# Altium project HPBIController.PrjPCB (part 2 of 8)

## Sheet ADC.SchDoc: 02290_Sonoma_Controller
size B; ApprovedBy: J Johnson; CheckedBy: J Johnson; Author: sdfasdfdfAEFfasdFfaF; DrawnBy: J Johnson; Organization: Opsero Electronic Design; Address1: 21-915 Av. Marguerite-Bourgeoys; Address2: Québec (QC); Address3: G1S 3X4; DocumentNumber: OP009-001-SCH; Revision: D-1; SheetNumber: 15; SheetTotal: 16; Tel1: (581) 308-8830; Tel2: (581) 308-8830; Project: 02290_Sonoma_Controller; CheckedDate: 2013-12-13; Sheet: ADC 3Msps 12-bit 16-channel; PageSetup: Record=PageOptions|CenterHorizontal=True|CenterVertical=True|PrintScale=1.08|XCorrection=1.00|YCorrection=1.00|PrintKind=0|BorderSize=5000000|LeftOffset=0|BottomOffset=0|Orientation=2|PaperLength=1000|PaperWidth=1000|Scale=100|PaperSource=7|PrintQuality=-4|MediaType=1|DitherType=10|PaperKind=Tabloid     [11 x 17 in]|PrintScaleMode=1; DrawDate: 2013-12-13; SchTitle: 02290_Sonoma_Controller; RevDescription: Replaced Q2,Q3 with STD16NF06LT4; RevDate: 2020-07-07; RevBy: J Johnson; RevDescription2: Added resistors to QSPI interface; ModifiedDate: 2020-07-07
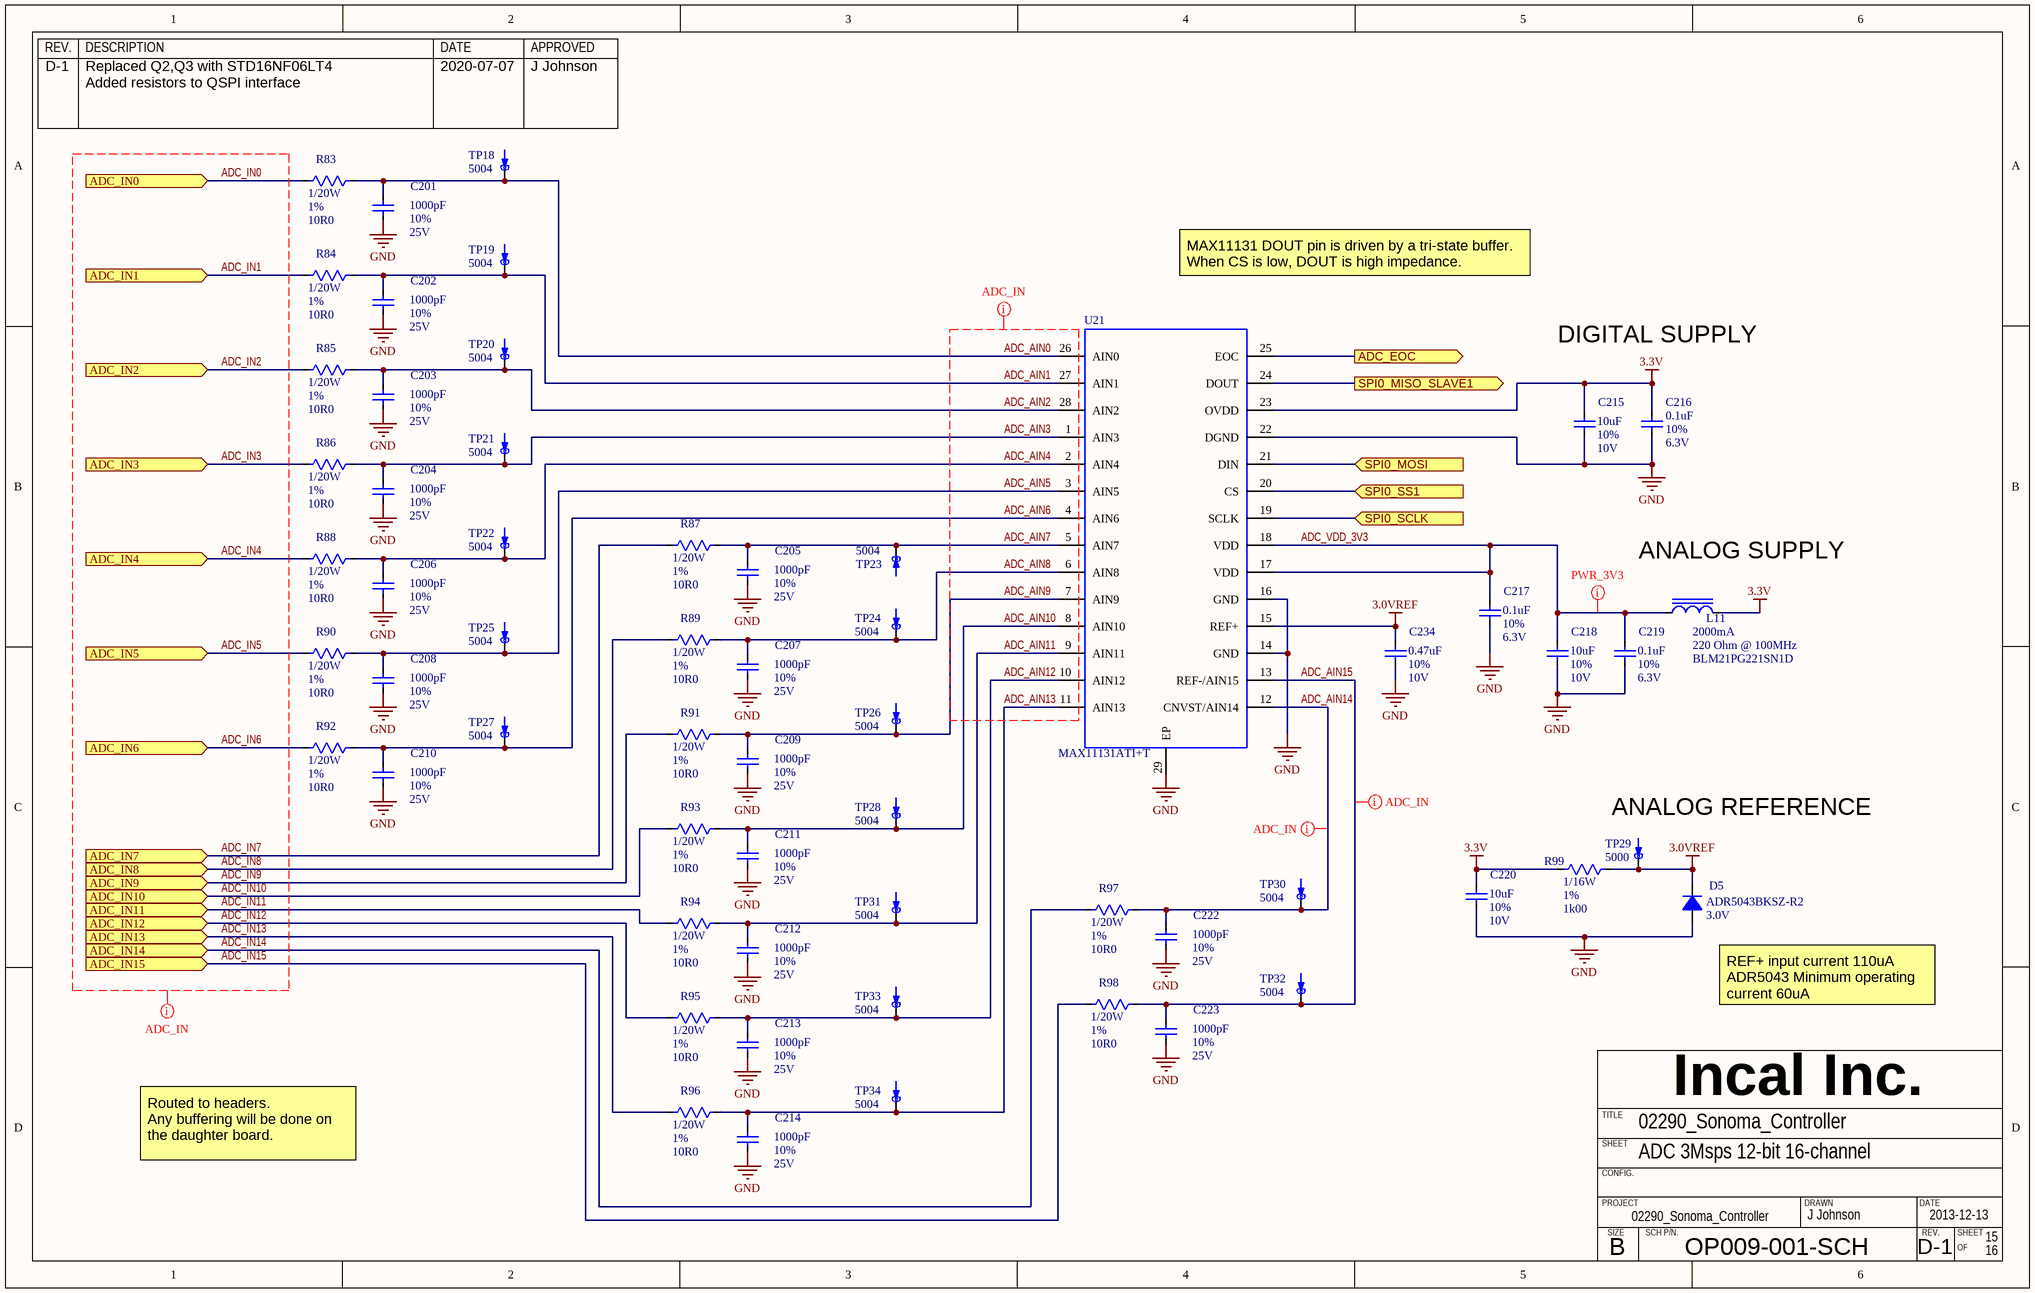
[diagram p1: ADC.SchDoc]

### Parts
C201  value 1000pF  Tolerance: 10%  Voltage: 25V  [CAPC0603X33N]  (hidden comment: CAPACITOR_NP_TYPE1)
C202  value 1000pF  Tolerance: 10%  Voltage: 25V  [CAPC0603X33N]  (hidden comment: CAPACITOR_NP_TYPE1)
C203  value 1000pF  Tolerance: 10%  Voltage: 25V  [CAPC0603X33N]  (hidden comment: CAPACITOR_NP_TYPE1)
C204  value 1000pF  Tolerance: 10%  Voltage: 25V  [CAPC0603X33N]  (hidden comment: CAPACITOR_NP_TYPE1)
C205  value 1000pF  Tolerance: 10%  Voltage: 25V  [CAPC0603X33N]  (hidden comment: CAPACITOR_NP_TYPE1)
C206  value 1000pF  Tolerance: 10%  Voltage: 25V  [CAPC0603X33N]  (hidden comment: CAPACITOR_NP_TYPE1)
C207  value 1000pF  Tolerance: 10%  Voltage: 25V  [CAPC0603X33N]  (hidden comment: CAPACITOR_NP_TYPE1)
C208  value 1000pF  Tolerance: 10%  Voltage: 25V  [CAPC0603X33N]  (hidden comment: CAPACITOR_NP_TYPE1)
C209  value 1000pF  Tolerance: 10%  Voltage: 25V  [CAPC0603X33N]  (hidden comment: CAPACITOR_NP_TYPE1)
C210  value 1000pF  Tolerance: 10%  Voltage: 25V  [CAPC0603X33N]  (hidden comment: CAPACITOR_NP_TYPE1)
C211  value 1000pF  Tolerance: 10%  Voltage: 25V  [CAPC0603X33N]  (hidden comment: CAPACITOR_NP_TYPE1)
C212  value 1000pF  Tolerance: 10%  Voltage: 25V  [CAPC0603X33N]  (hidden comment: CAPACITOR_NP_TYPE1)
C213  value 1000pF  Tolerance: 10%  Voltage: 25V  [CAPC0603X33N]  (hidden comment: CAPACITOR_NP_TYPE1)
C214  value 1000pF  Tolerance: 10%  Voltage: 25V  [CAPC0603X33N]  (hidden comment: CAPACITOR_NP_TYPE1)
C215  value 10uF  Tolerance: 10%  Voltage: 10V  [CAPC1608X38N]  (hidden comment: CAPACITOR_NP_TYPE1)
C216  value 0.1uF  Tolerance: 10%  Voltage: 6.3V  [CAPC0603X33N]  (hidden comment: CAPACITOR_NP_TYPE1)
C217  value 0.1uF  Tolerance: 10%  Voltage: 6.3V  [CAPC0603X33N]  (hidden comment: CAPACITOR_NP_TYPE1)
C218  value 10uF  Tolerance: 10%  Voltage: 10V  [CAPC1608X38N]  (hidden comment: CAPACITOR_NP_TYPE1)
C219  value 0.1uF  Tolerance: 10%  Voltage: 6.3V  [CAPC0603X33N]  (hidden comment: CAPACITOR_NP_TYPE1)
C220  value 10uF  Tolerance: 10%  Voltage: 10V  [CAPC1608X38N]  (hidden comment: CAPACITOR_NP_TYPE1)
C222  value 1000pF  Tolerance: 10%  Voltage: 25V  [CAPC0603X33N]  (hidden comment: CAPACITOR_NP_TYPE1)
C223  value 1000pF  Tolerance: 10%  Voltage: 25V  [CAPC0603X33N]  (hidden comment: CAPACITOR_NP_TYPE1)
C234  value 0.47uF  Tolerance: 10%  Voltage: 10V  [CAPC1005X55N]  (hidden comment: CAPACITOR_NP_TYPE1)
D5  value 3.0V  Mfg Part Number 1: ADR5043BKSZ-R2  [SOT65P210X110-3N]  (hidden comment: DIODE_TYPE3)
L11  value 220 Ohm @ 100MHz  Current: 2000mA  Mfg Part Number 1: BLM21PG221SN1D  [INDC2012X85N]  (hidden comment: INDUCTOR_CORE_TYPE1)
R83  value 10R0  Power: 1/20W  Tolerance: 1%  [RESC1005X33N]  (hidden comment: *)
R84  value 10R0  Power: 1/20W  Tolerance: 1%  [RESC1005X33N]  (hidden comment: *)
R85  value 10R0  Power: 1/20W  Tolerance: 1%  [RESC1005X33N]  (hidden comment: *)
R86  value 10R0  Power: 1/20W  Tolerance: 1%  [RESC1005X33N]  (hidden comment: *)
R87  value 10R0  Power: 1/20W  Tolerance: 1%  [RESC1005X33N]  (hidden comment: *)
R88  value 10R0  Power: 1/20W  Tolerance: 1%  [RESC1005X33N]  (hidden comment: *)
R89  value 10R0  Power: 1/20W  Tolerance: 1%  [RESC1005X33N]  (hidden comment: *)
R90  value 10R0  Power: 1/20W  Tolerance: 1%  [RESC1005X33N]  (hidden comment: *)
R91  value 10R0  Power: 1/20W  Tolerance: 1%  [RESC1005X33N]  (hidden comment: *)
R92  value 10R0  Power: 1/20W  Tolerance: 1%  [RESC1005X33N]  (hidden comment: *)
R93  value 10R0  Power: 1/20W  Tolerance: 1%  [RESC1005X33N]  (hidden comment: *)
R94  value 10R0  Power: 1/20W  Tolerance: 1%  [RESC1005X33N]  (hidden comment: *)
R95  value 10R0  Power: 1/20W  Tolerance: 1%  [RESC1005X33N]  (hidden comment: *)
R96  value 10R0  Power: 1/20W  Tolerance: 1%  [RESC1005X33N]  (hidden comment: *)
R97  value 10R0  Power: 1/20W  Tolerance: 1%  [RESC1005X33N]  (hidden comment: *)
R98  value 10R0  Power: 1/20W  Tolerance: 1%  [RESC1005X33N]  (hidden comment: *)
R99  value 1k00  Power: 1/16W  Tolerance: 1%  [RESC1005X33N]  (hidden comment: *)
TP18  value 5004  [KEY_5004]  (hidden comment: TEST_POINT_TYPE4)
TP19  value 5004  [KEY_5004]  (hidden comment: TEST_POINT_TYPE4)
TP20  value 5004  [KEY_5004]  (hidden comment: TEST_POINT_TYPE4)
TP21  value 5004  [KEY_5004]  (hidden comment: TEST_POINT_TYPE4)
TP22  value 5004  [KEY_5004]  (hidden comment: TEST_POINT_TYPE4)
TP23  value 5004  [KEY_5004]  (hidden comment: TEST_POINT_TYPE4)
TP24  value 5004  [KEY_5004]  (hidden comment: TEST_POINT_TYPE4)
TP25  value 5004  [KEY_5004]  (hidden comment: TEST_POINT_TYPE4)
TP26  value 5004  [KEY_5004]  (hidden comment: TEST_POINT_TYPE4)
TP27  value 5004  [KEY_5004]  (hidden comment: TEST_POINT_TYPE4)
TP28  value 5004  [KEY_5004]  (hidden comment: TEST_POINT_TYPE4)
TP29  value 5000  [KEY_5000]  (hidden comment: TEST_POINT_TYPE4)
TP30  value 5004  [KEY_5004]  (hidden comment: TEST_POINT_TYPE4)
TP31  value 5004  [KEY_5004]  (hidden comment: TEST_POINT_TYPE4)
TP32  value 5004  [KEY_5004]  (hidden comment: TEST_POINT_TYPE4)
TP33  value 5004  [KEY_5004]  (hidden comment: TEST_POINT_TYPE4)
TP34  value 5004  [KEY_5004]  (hidden comment: TEST_POINT_TYPE4)
U21  MAX11131ATI+T  [TQFN50P500X500X75-28N]

### Ports
ADC_EOC (out), ADC_IN0 (in), ADC_IN1 (in), ADC_IN2 (in), ADC_IN3 (in), ADC_IN4 (in), ADC_IN5 (in), ADC_IN6 (in), ADC_IN7 (in), ADC_IN8 (in), ADC_IN9 (in), ADC_IN10 (in), ADC_IN11 (in), ADC_IN12 (in), ADC_IN13 (in), ADC_IN14 (in), ADC_IN15 (in), SPI0_MISO_SLAVE1 (out), SPI0_MOSI (in), SPI0_SCLK (in), SPI0_SS1 (in)

### Nets
3.0VREF: C234.1 D5.1(K) R99.2 TP29.1 U21.15(REF+)
3.3V: C215.1 C216.1 C220.1 L11.2 R99.1 U21.23(OVDD)
GND: C201.2 C202.2 C203.2 C204.2 C205.2 C206.2 C207.2 C208.2 C209.2 C210.2 C211.2 C212.2 C213.2 C214.2 C215.2 C216.2 C217.2 C218.2 C219.2 C220.2 C222.2 C223.2 C234.2 D5.2(A) U21.14(GND) U21.16(GND) U21.22(DGND) U21.29(EP)
ADC_AIN0: C201.1 R83.2 TP18.1 U21.26(AIN0)
ADC_AIN1: C202.1 R84.2 TP19.1 U21.27(AIN1)
ADC_AIN2: C203.1 R85.2 TP20.1 U21.28(AIN2)
ADC_AIN3: C204.1 R86.2 TP21.1 U21.1(AIN3)
ADC_AIN4: C206.1 R88.2 TP22.1 U21.2(AIN4)
ADC_AIN5: C208.1 R90.2 TP25.1 U21.3(AIN5)
ADC_AIN6: C210.1 R92.2 TP27.1 U21.4(AIN6)
ADC_AIN7: C205.1 R87.2 TP23.1 U21.5(AIN7)
ADC_AIN8: C207.1 R89.2 TP24.1 U21.6(AIN8)
ADC_AIN9: C209.1 R91.2 TP26.1 U21.7(AIN9)
ADC_AIN10: C211.1 R93.2 TP28.1 U21.8(AIN10)
ADC_AIN11: C212.1 R94.2 TP31.1 U21.9(AIN11)
ADC_AIN12: C213.1 R95.2 TP33.1 U21.10(AIN12)
ADC_AIN13: C214.1 R96.2 TP34.1 U21.11(AIN13)
ADC_AIN14: C222.1 R97.2 TP30.1 U21.12(CNVST/AIN14)
ADC_AIN15: C223.1 R98.2 TP32.1 U21.13(REF-/AIN15)
ADC_EOC: U21.25(EOC) ; port ADC_EOC
ADC_IN0: R83.1 ; port ADC_IN0
ADC_IN1: R84.1 ; port ADC_IN1
ADC_IN2: R85.1 ; port ADC_IN2
ADC_IN3: R86.1 ; port ADC_IN3
ADC_IN4: R88.1 ; port ADC_IN4
ADC_IN5: R90.1 ; port ADC_IN5
ADC_IN6: R92.1 ; port ADC_IN6
ADC_IN7: R87.1 ; port ADC_IN7
ADC_IN8: R89.1 ; port ADC_IN8
ADC_IN9: R91.1 ; port ADC_IN9
ADC_IN10: R93.1 ; port ADC_IN10
ADC_IN11: R94.1 ; port ADC_IN11
ADC_IN12: R95.1 ; port ADC_IN12
ADC_IN13: R96.1 ; port ADC_IN13
ADC_IN14: R97.1 ; port ADC_IN14
ADC_IN15: R98.1 ; port ADC_IN15
ADC_VDD_3V3: C217.1 C218.1 C219.1 L11.1 U21.17(VDD) U21.18(VDD)
SPI0_MISO_SLAVE1: U21.24(DOUT) ; port SPI0_MISO_SLAVE1
SPI0_MOSI: U21.21(DIN) ; port SPI0_MOSI
SPI0_SCLK: U21.19(SCLK) ; port SPI0_SCLK
SPI0_SS1: U21.20(CS) ; port SPI0_SS1

### Layout directives
net class Power_3V3: ADC_VDD_3V3
net class ADC_IN(0-15): ADC_AIN0, ADC_AIN1, ADC_AIN2, ADC_AIN3, ADC_AIN4, ADC_AIN5, ADC_AIN6, ADC_AIN7, ADC_AIN8, ADC_AIN9, ADC_AIN10, ADC_AIN11, ADC_AIN12, ADC_AIN13, ADC_AIN14, ADC_AIN15, ADC_IN0, ADC_IN1, ADC_IN2, ADC_IN3, ADC_IN4, ADC_IN5, ADC_IN6, ADC_IN7, ADC_IN8, ADC_IN9, ADC_IN10, ADC_IN11, ADC_IN12, ADC_IN13, ADC_IN14, ADC_IN15

### Notes on the sheet
- MAX11131 DOUT pin is driven by a tri-state buffer.
  When CS is low, DOUT is high impedance.
- DIGITAL SUPPLY
- (near L11) ANALOG SUPPLY
- ANALOG REFERENCE
- (near D5) REF+ input current 110uA
  ADR5043 Minimum operating current 60uA
- Routed to headers.
  Any buffering will be done on the daughter board.
- REV.
- DESCRIPTION
- DATE
- APPROVED
- Incal Inc.
- SHEET
- TITLE
- CONFIG.
- PROJECT
- SIZE
- SCH P/N.
- DRAWN
- B
- OF

### Library data of the parts
C201-C214 C222 C223 = C0201_1000pF_10%_25V_X5R: Capacitor ceramic, X5R, 1000pF, 25V, 10%, -55 to +85 C, EIA0201; Manufacturer 1: TDK; Mfg Part Number 1: C0603X5R1E102K030BA; EIA(I) Package: 0201; EIA(M) Package: 0603; ASSY: USED; Status: Active; Power: *; Current: *; Part Ref: C0201_1000pF_10%_25V_X5R; Comment_1: *; RoHs: True; Operating Temp: -55 to +85 C
C215 C218 C220 = C0603_10uF_10%_10V_X5R: Capacitor ceramic, X5R, 10uF, 10V, 10%, -55 to +85 C, EIA0603; Manufacturer 1: TDK Corporation; Mfg Part Number 1: C1608X5R1A106K080AC; EIA(I) Package: 0603; EIA(M) Package: 1608; ASSY: USED; Status: Active; Power: *; Current: *; Part Ref: C0603_10uF_10%_10V_X5R; Comment_1: *; RoHs: True; Operating Temp: -55 to +85 C
C216 C217 C219 = C0201_0.1uF_10%_6.3V_X5R: Capacitor ceramic, X5R, 0.1uF, 6.3V, 10%, -55 to +125 C, EIA0201; Manufacturer 1: Murata; Mfg Part Number 1: GRM033R60J104KE19D; EIA(I) Package: 0201; EIA(M) Package: 0603; ASSY: USED; Status: Active; Power: *; Current: *; Part Ref: C0201_0.1uF_10%_6.3V_X5R; Comment_1: *; RoHs: True; Operating Temp: -55 to +85 C
C234 = C0402_0.47uF_10%_10V_X5R: Capacitor ceramic, X5R, 0.47uF, 10V, 10%, -55 to +85 C, EIA0402; Manufacturer 1: MURATA; Mfg Part Number 1: GRM155R61A474KE15D; EIA(I) Package: 0402; EIA(M) Package: 1005; ASSY: USED; Status: Active; Power: *; Current: *; Part Ref: C0402_0.47uF_10%_10V_X5R; Comment_1: *; RoHs: True; Operating Temp: -55 to +85 C; Datasheet 1: ..\datasheet\Capacitor\Murata\GRM_Serie\GRM155R61A_X5R\2012-10-27
D5 = ADR5043BKSZ-R2: Reference Shunt 3.0V, 3-lead SC70; Manufacturer 1: Analog Devices; Current: 15mA; Tolerance: 0.1%; ASSY: USED; Status: Active; Power: *; EIA(I) Package: *; EIA(M) Package: *; Part Ref: ADR5043BKSZ-R2; Comment_1: *; RoHs: True; Package: SC70; Voltage: 3.0V; Operating Temp: -40 to +125 C
L11 = BLM21PG221SN1D: Ferrite chip, 220 Ohm @ 100MHz, 2000mA, 25%, -55 to +125 C, 0805; Manufacturer 1: Murata; EIA(I) Package: 0805; EIA(M) Package: 2012; ASSY: USED; Status: Active; Power: *; Part Ref: BLM21PG221SN1D; Voltage: *; Comment_1: *; RoHs: True; Tolerance: 25%; Operating Temp: -55 to +125 C
R83-R98 = R0201_10R0_1%: Resistor, 10R0, 1/20W, 1%, -50 to +155 C, EIA0201, EIA(M)0603; Manufacturer 1: Yageo; Mfg Part Number 1: RC0201FR-0710RL; EIA(I) Package: 0201; EIA(M) Package: 0603; Voltage: 50V; ASSY: USED; Status: Active; Part Ref: R0201_10R0_1%; Current: *; Comment_1: *; RoHs: True; Package: 0201; Operating Temp: -50 to +155 C
R99 = R0402_1k00_1%: Resistor, 1k00, 1/16W, 1%, -55 to +155 C, EIA0402; Manufacturer 1: Yageo; Mfg Part Number 1: RC0402FR-071K00L; EIA(I) Package: 0402; EIA(M) Package: 1005; Voltage: 50V; ASSY: USED; Status: Active; Part Ref: R0402_1k00_1%; Current: *; Comment_1: *; RoHs: True; Operating Temp: -55 to +155 C; Datasheet 1: ..\datasheet\Resistor\Yaego\Thick_Film\RC0402\2012-03-29; Manufacturer 2: Vishay Dale; Mfg Part Number 2: CRCW04021k00FKED; Datasheet 2: ..\datasheet\Resistor\Vishay Dale\CRC\2012-03-29
TP18-TP28 TP30-TP34 = 5004: Test point bead, yellow, Keystone Electronics, Thru-hole,; Manufacturer 1: Keystone inc; ASSY: USED; Power: Pow; Current: Cur; Voltage: Vol; Comment_1: Com; Status: Active; EIA(I) Package: *; EIA(M) Package: *; Part Ref: 5004; Tolerance: *; Package: *; RoHs: True; Mfg Part Number 1: 5004; Datasheet 1: ..\datasheet\Connector\Keystone Electronics\5001-5014\2012-06-28
TP29 = 5000: Test point bead, red, Keystone Electronics, Thru-hole,; Manufacturer 1: Keystone inc; ASSY: USED; Power: Pow; Current: Cur; Voltage: Vol; Comment_1: Com; Status: Active; EIA(I) Package: *; EIA(M) Package: *; Part Ref: 5000; Tolerance: *; Package: *; RoHs: True; Mfg Part Number 1: 5000; Datasheet 1: ..\datasheet\Connector\Keystone Electronics\5001-5014\2012-06-28
U21 = MAX11131ATI+T: ADC 12bit, 3Msps, 16 channels,2.35V to 3.6V, TQFN, -40 to +125 C; Manufacturer 1: Maxim; PART NUMBER: MAX11131ATI+T; Part Ref: MAX11131ATI+T; Status: Active; RoHs: True; Value: MAX11131ATI+T; Mfg Part Number 1: MAX11131ATI+T; Package: TQFN28

## Sheet Bank0-13-33.SchDoc: 02290_Sonoma_Controller
size B; ApprovedBy: J Johnson; CheckedBy: J Johnson; Author: sdfasdfdfAEFfasdFfaF; DrawnBy: J Johnson; Organization: Opsero Electronic Design; Address1: 21-915 Av. Marguerite-Bourgeoys; Address2: Québec (QC); Address3: G1S 3X4; DocumentNumber: OP009-001-SCH; Revision: D-1; SheetNumber: 07; SheetTotal: 16; Tel1: (581) 308-8830; Tel2: (581) 308-8830; Project: 02290_Sonoma_Controller; CheckedDate: 2013-12-13; Sheet: Bank0, Bank13 & Bank33; PageSetup: Record=PageOptions|CenterHorizontal=True|CenterVertical=True|PrintScale=1.08|XCorrection=1.00|YCorrection=1.00|PrintKind=0|BorderSize=5000000|LeftOffset=0|BottomOffset=0|Orientation=2|PaperLength=1000|PaperWidth=1000|Scale=100|PaperSource=7|PrintQuality=-4|MediaType=1|DitherType=10|PaperKind=Tabloid     [11 x 17 in]|PrintScaleMode=1; DrawDate: 2013-12-13; SchTitle: 02290_Sonoma_Controller; RevDescription: Replaced Q2,Q3 with STD16NF06LT4; RevDate: 2020-07-07; RevBy: J Johnson; RevDescription2: Added resistors to QSPI interface; ModifiedDate: 2020-07-07
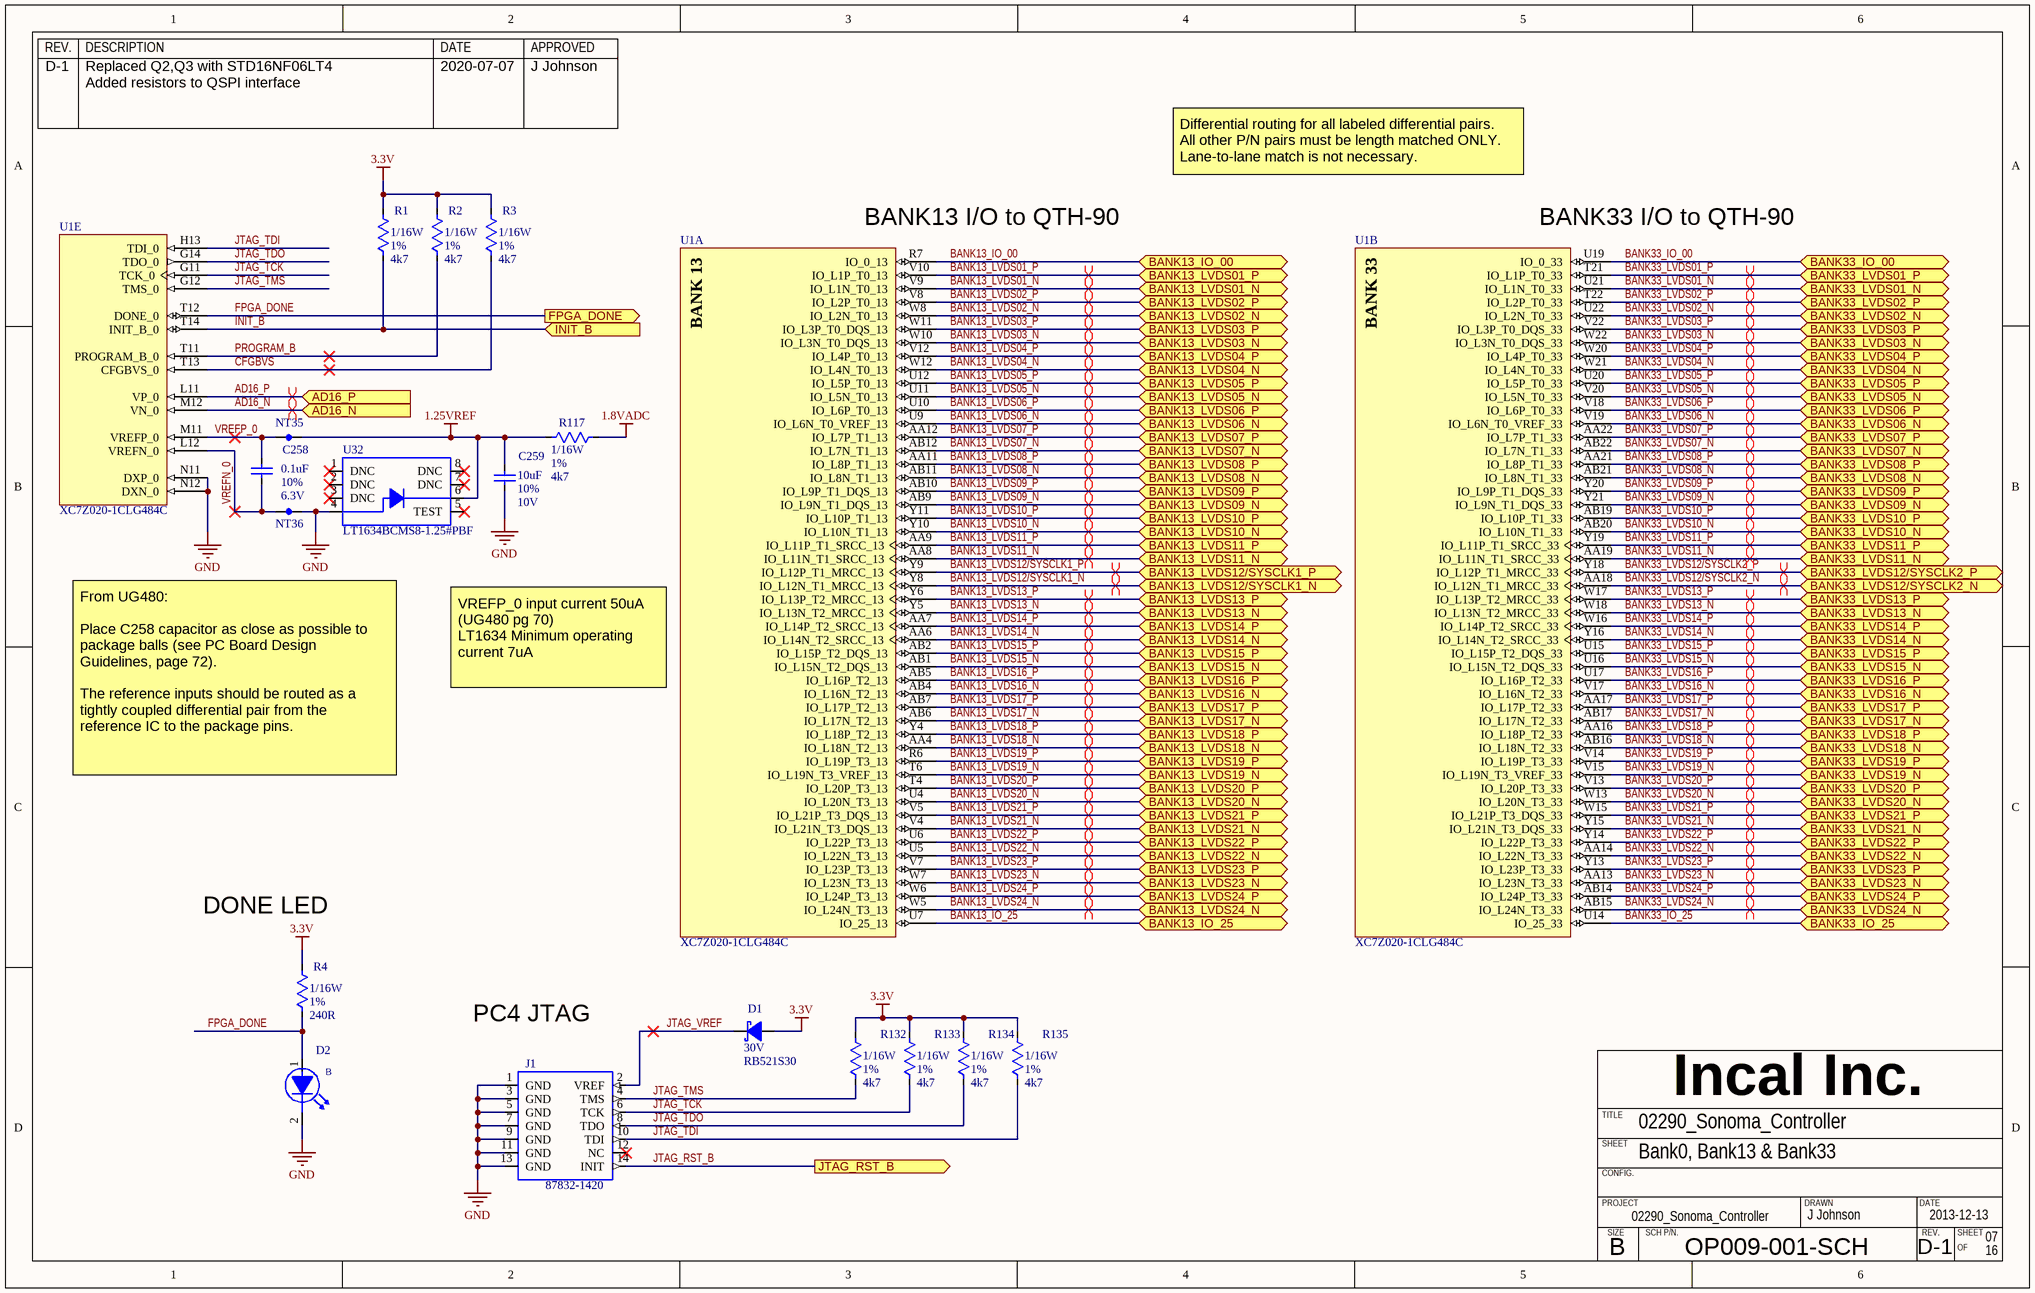
[diagram p2: Bank0-13-33.SchDoc]

### Parts
C258  value 0.1uF  Tolerance: 10%  Voltage: 6.3V  [CAPC0603X33N]  (hidden comment: CAPACITOR_NP_TYPE1)
C259  value 10uF  Tolerance: 10%  Voltage: 10V  [CAPC1608X38N]  (hidden comment: CAPACITOR_NP_TYPE1)
D1  value RB521S30  Voltage: 30V  [SOD15080X70]  (hidden comment: DIODE_SCHOTTKY_TYPE1)
D2  LED_BLU  [LEDM1608X38N-BLU]  (value not drawn)
J1  XILINX-JTAG-2x7  [87832-1420]  (value not drawn)
NT35  NET_TIE_1X1  [NET_TIE_1X1]  (value not drawn)  (net tie, no BOM)
NT36  NET_TIE_1X1  [NET_TIE_1X1]  (value not drawn)  (net tie, no BOM)
R1  value 4k7  Power: 1/16W  Tolerance: 1%  [RESC1005X33N]  (hidden comment: *)
R2  value 4k7  Power: 1/16W  Tolerance: 1%  [RESC1005X33N]  (hidden comment: *)
R3  value 4k7  Power: 1/16W  Tolerance: 1%  [RESC1005X33N]  (hidden comment: *)
R4  value 240R  Power: 1/16W  Tolerance: 1%  [RESC1005X33N]  (hidden comment: *)
R117  value 4k7  Power: 1/16W  Tolerance: 1%  [RESC1005X33N]  (hidden comment: *)
R132  value 4k7  Power: 1/16W  Tolerance: 1%  [RESC1005X33N]  (hidden comment: *)
R133  value 4k7  Power: 1/16W  Tolerance: 1%  [RESC1005X33N]  (hidden comment: *)
R134  value 4k7  Power: 1/16W  Tolerance: 1%  [RESC1005X33N]  (hidden comment: *)
R135  value 4k7  Power: 1/16W  Tolerance: 1%  [RESC1005X33N]  (hidden comment: *)
U1  XC7Z020-1CLG484C  [CLG484]  (parts A,B,E of 10)
U32  Mfg Part Number 1: LT1634BCMS8-1.25#PBF  [SOP65P490X110-8N]  (hidden comment: LT1634)

### Ports
AD16_N (in), AD16_P (in), BANK13_IO_00 (bidir), BANK13_IO_25 (bidir), BANK13_LVDS01_N (bidir), BANK13_LVDS01_P (bidir), BANK13_LVDS02_N (bidir), BANK13_LVDS02_P (bidir), BANK13_LVDS03_N (bidir), BANK13_LVDS03_P (bidir), BANK13_LVDS04_N (bidir), BANK13_LVDS04_P (bidir), BANK13_LVDS05_N (bidir), BANK13_LVDS05_P (bidir), BANK13_LVDS06_N (bidir), BANK13_LVDS06_P (bidir), BANK13_LVDS07_N (bidir), BANK13_LVDS07_P (bidir), BANK13_LVDS08_N (bidir), BANK13_LVDS08_P (bidir), BANK13_LVDS09_N (bidir), BANK13_LVDS09_P (bidir), BANK13_LVDS10_N (bidir), BANK13_LVDS10_P (bidir), BANK13_LVDS11_N (bidir), BANK13_LVDS11_P (bidir), BANK13_LVDS12/SYSCLK1_N (bidir), BANK13_LVDS12/SYSCLK1_P (bidir), BANK13_LVDS13_N (bidir), BANK13_LVDS13_P (bidir), BANK13_LVDS14_N (bidir), BANK13_LVDS14_P (bidir), BANK13_LVDS15_N (bidir), BANK13_LVDS15_P (bidir), BANK13_LVDS16_N (bidir), BANK13_LVDS16_P (bidir), BANK13_LVDS17_N (bidir), BANK13_LVDS17_P (bidir), BANK13_LVDS18_N (bidir), BANK13_LVDS18_P (bidir), BANK13_LVDS19_N (bidir), BANK13_LVDS19_P (bidir), BANK13_LVDS20_N (bidir), BANK13_LVDS20_P (bidir), BANK13_LVDS21_N (bidir), BANK13_LVDS21_P (bidir), BANK13_LVDS22_N (bidir), BANK13_LVDS22_P (bidir), BANK13_LVDS23_N (bidir), BANK13_LVDS23_P (bidir), BANK13_LVDS24_N (bidir), BANK13_LVDS24_P (bidir), BANK33_IO_00 (bidir), BANK33_IO_25 (bidir), BANK33_LVDS01_N (bidir), BANK33_LVDS01_P (bidir), BANK33_LVDS02_N (bidir), BANK33_LVDS02_P (bidir), BANK33_LVDS03_N (bidir), BANK33_LVDS03_P (bidir), BANK33_LVDS04_N (bidir), BANK33_LVDS04_P (bidir), BANK33_LVDS05_N (bidir), BANK33_LVDS05_P (bidir), BANK33_LVDS06_N (bidir), BANK33_LVDS06_P (bidir), BANK33_LVDS07_N (bidir), BANK33_LVDS07_P (bidir), BANK33_LVDS08_N (bidir), BANK33_LVDS08_P (bidir), BANK33_LVDS09_N (bidir), BANK33_LVDS09_P (bidir), BANK33_LVDS10_N (bidir), BANK33_LVDS10_P (bidir), BANK33_LVDS11_N (bidir), BANK33_LVDS11_P (bidir), BANK33_LVDS12/SYSCLK2_N (bidir), BANK33_LVDS12/SYSCLK2_P (bidir), BANK33_LVDS13_N (bidir), BANK33_LVDS13_P (bidir), BANK33_LVDS14_N (bidir), BANK33_LVDS14_P (bidir), BANK33_LVDS15_N (bidir), BANK33_LVDS15_P (bidir), BANK33_LVDS16_N (bidir), BANK33_LVDS16_P (bidir), BANK33_LVDS17_N (bidir), BANK33_LVDS17_P (bidir), BANK33_LVDS18_N (bidir), BANK33_LVDS18_P (bidir), BANK33_LVDS19_N (bidir), BANK33_LVDS19_P (bidir), BANK33_LVDS20_N (bidir), BANK33_LVDS20_P (bidir), BANK33_LVDS21_N (bidir), BANK33_LVDS21_P (bidir), BANK33_LVDS22_N (bidir), BANK33_LVDS22_P (bidir), BANK33_LVDS23_N (bidir), BANK33_LVDS23_P (bidir), BANK33_LVDS24_N (bidir), BANK33_LVDS24_P (bidir), FPGA_DONE (out), INIT_B (in), JTAG_RST_B (out)

### Nets
1.8VADC: R117.2
1.25VREF: C259.1 NT35.2 R117.1 U32.6(VOUT)
3.3V: D1.1(A) R1.2 R2.2 R3.2 R4.2 R132.2 R133.2 R134.2 R135.2
GND: C259.2 D2.2(K) J1.1(GND) J1.3(GND) J1.5(GND) J1.7(GND) J1.9(GND) J1.11(GND) J1.13(GND) NT36.2 U1.N11(DXP_0) U1.N12(DXN_0) U32.4(GND)
AD16_N: U1.M12(VN_0) ; port AD16_N
AD16_P: U1.L11(VP_0) ; port AD16_P
BANK13_IO_00: U1.R7(IO_0_13) ; port BANK13_IO_00
BANK13_IO_25: U1.U7(IO_25_13) ; port BANK13_IO_25
BANK13_LVDS01_N: U1.V9(IO_L1N_T0_13) ; port BANK13_LVDS01_N
BANK13_LVDS01_P: U1.V10(IO_L1P_T0_13) ; port BANK13_LVDS01_P
BANK13_LVDS02_N: U1.W8(IO_L2N_T0_13) ; port BANK13_LVDS02_N
BANK13_LVDS02_P: U1.V8(IO_L2P_T0_13) ; port BANK13_LVDS02_P
BANK13_LVDS03_N: U1.W10(IO_L3N_T0_DQS_13) ; port BANK13_LVDS03_N
BANK13_LVDS03_P: U1.W11(IO_L3P_T0_DQS_13) ; port BANK13_LVDS03_P
BANK13_LVDS04_N: U1.W12(IO_L4N_T0_13) ; port BANK13_LVDS04_N
BANK13_LVDS04_P: U1.V12(IO_L4P_T0_13) ; port BANK13_LVDS04_P
BANK13_LVDS05_N: U1.U11(IO_L5N_T0_13) ; port BANK13_LVDS05_N
BANK13_LVDS05_P: U1.U12(IO_L5P_T0_13) ; port BANK13_LVDS05_P
BANK13_LVDS06_N: U1.U9(IO_L6N_T0_VREF_13) ; port BANK13_LVDS06_N
BANK13_LVDS06_P: U1.U10(IO_L6P_T0_13) ; port BANK13_LVDS06_P
BANK13_LVDS07_N: U1.AB12(IO_L7N_T1_13) ; port BANK13_LVDS07_N
BANK13_LVDS07_P: U1.AA12(IO_L7P_T1_13) ; port BANK13_LVDS07_P
BANK13_LVDS08_N: U1.AB11(IO_L8N_T1_13) ; port BANK13_LVDS08_N
BANK13_LVDS08_P: U1.AA11(IO_L8P_T1_13) ; port BANK13_LVDS08_P
BANK13_LVDS09_N: U1.AB9(IO_L9N_T1_DQS_13) ; port BANK13_LVDS09_N
BANK13_LVDS09_P: U1.AB10(IO_L9P_T1_DQS_13) ; port BANK13_LVDS09_P
BANK13_LVDS10_N: U1.Y10(IO_L10N_T1_13) ; port BANK13_LVDS10_N
BANK13_LVDS10_P: U1.Y11(IO_L10P_T1_13) ; port BANK13_LVDS10_P
BANK13_LVDS11_N: U1.AA8(IO_L11N_T1_SRCC_13) ; port BANK13_LVDS11_N
BANK13_LVDS11_P: U1.AA9(IO_L11P_T1_SRCC_13) ; port BANK13_LVDS11_P
BANK13_LVDS12/SYSCLK1_N: U1.Y8(IO_L12N_T1_MRCC_13) ; port BANK13_LVDS12/SYSCLK1_N
BANK13_LVDS12/SYSCLK1_P: U1.Y9(IO_L12P_T1_MRCC_13) ; port BANK13_LVDS12/SYSCLK1_P
BANK13_LVDS13_N: U1.Y5(IO_L13N_T2_MRCC_13) ; port BANK13_LVDS13_N
BANK13_LVDS13_P: U1.Y6(IO_L13P_T2_MRCC_13) ; port BANK13_LVDS13_P
BANK13_LVDS14_N: U1.AA6(IO_L14N_T2_SRCC_13) ; port BANK13_LVDS14_N
BANK13_LVDS14_P: U1.AA7(IO_L14P_T2_SRCC_13) ; port BANK13_LVDS14_P
BANK13_LVDS15_N: U1.AB1(IO_L15N_T2_DQS_13) ; port BANK13_LVDS15_N
BANK13_LVDS15_P: U1.AB2(IO_L15P_T2_DQS_13) ; port BANK13_LVDS15_P
BANK13_LVDS16_N: U1.AB4(IO_L16N_T2_13) ; port BANK13_LVDS16_N
BANK13_LVDS16_P: U1.AB5(IO_L16P_T2_13) ; port BANK13_LVDS16_P
BANK13_LVDS17_N: U1.AB6(IO_L17N_T2_13) ; port BANK13_LVDS17_N
BANK13_LVDS17_P: U1.AB7(IO_L17P_T2_13) ; port BANK13_LVDS17_P
BANK13_LVDS18_N: U1.AA4(IO_L18N_T2_13) ; port BANK13_LVDS18_N
BANK13_LVDS18_P: U1.Y4(IO_L18P_T2_13) ; port BANK13_LVDS18_P
BANK13_LVDS19_N: U1.T6(IO_L19N_T3_VREF_13) ; port BANK13_LVDS19_N
BANK13_LVDS19_P: U1.R6(IO_L19P_T3_13) ; port BANK13_LVDS19_P
BANK13_LVDS20_N: U1.U4(IO_L20N_T3_13) ; port BANK13_LVDS20_N
BANK13_LVDS20_P: U1.T4(IO_L20P_T3_13) ; port BANK13_LVDS20_P
BANK13_LVDS21_N: U1.V4(IO_L21N_T3_DQS_13) ; port BANK13_LVDS21_N
BANK13_LVDS21_P: U1.V5(IO_L21P_T3_DQS_13) ; port BANK13_LVDS21_P
BANK13_LVDS22_N: U1.U5(IO_L22N_T3_13) ; port BANK13_LVDS22_N
BANK13_LVDS22_P: U1.U6(IO_L22P_T3_13) ; port BANK13_LVDS22_P
BANK13_LVDS23_N: U1.W7(IO_L23N_T3_13) ; port BANK13_LVDS23_N
BANK13_LVDS23_P: U1.V7(IO_L23P_T3_13) ; port BANK13_LVDS23_P
BANK13_LVDS24_N: U1.W5(IO_L24N_T3_13) ; port BANK13_LVDS24_N
BANK13_LVDS24_P: U1.W6(IO_L24P_T3_13) ; port BANK13_LVDS24_P
BANK33_IO_00: U1.U19(IO_0_33) ; port BANK33_IO_00
BANK33_IO_25: U1.U14(IO_25_33) ; port BANK33_IO_25
BANK33_LVDS01_N: U1.U21(IO_L1N_T0_33) ; port BANK33_LVDS01_N
BANK33_LVDS01_P: U1.T21(IO_L1P_T0_33) ; port BANK33_LVDS01_P
BANK33_LVDS02_N: U1.U22(IO_L2N_T0_33) ; port BANK33_LVDS02_N
BANK33_LVDS02_P: U1.T22(IO_L2P_T0_33) ; port BANK33_LVDS02_P
BANK33_LVDS03_N: U1.W22(IO_L3N_T0_DQS_33) ; port BANK33_LVDS03_N
BANK33_LVDS03_P: U1.V22(IO_L3P_T0_DQS_33) ; port BANK33_LVDS03_P
BANK33_LVDS04_N: U1.W21(IO_L4N_T0_33) ; port BANK33_LVDS04_N
BANK33_LVDS04_P: U1.W20(IO_L4P_T0_33) ; port BANK33_LVDS04_P
BANK33_LVDS05_N: U1.V20(IO_L5N_T0_33) ; port BANK33_LVDS05_N
BANK33_LVDS05_P: U1.U20(IO_L5P_T0_33) ; port BANK33_LVDS05_P
BANK33_LVDS06_N: U1.V19(IO_L6N_T0_VREF_33) ; port BANK33_LVDS06_N
BANK33_LVDS06_P: U1.V18(IO_L6P_T0_33) ; port BANK33_LVDS06_P
BANK33_LVDS07_N: U1.AB22(IO_L7N_T1_33) ; port BANK33_LVDS07_N
BANK33_LVDS07_P: U1.AA22(IO_L7P_T1_33) ; port BANK33_LVDS07_P
BANK33_LVDS08_N: U1.AB21(IO_L8N_T1_33) ; port BANK33_LVDS08_N
BANK33_LVDS08_P: U1.AA21(IO_L8P_T1_33) ; port BANK33_LVDS08_P
BANK33_LVDS09_N: U1.Y21(IO_L9N_T1_DQS_33) ; port BANK33_LVDS09_N
BANK33_LVDS09_P: U1.Y20(IO_L9P_T1_DQS_33) ; port BANK33_LVDS09_P
BANK33_LVDS10_N: U1.AB20(IO_L10N_T1_33) ; port BANK33_LVDS10_N
BANK33_LVDS10_P: U1.AB19(IO_L10P_T1_33) ; port BANK33_LVDS10_P
BANK33_LVDS11_N: U1.AA19(IO_L11N_T1_SRCC_33) ; port BANK33_LVDS11_N
BANK33_LVDS11_P: U1.Y19(IO_L11P_T1_SRCC_33) ; port BANK33_LVDS11_P
BANK33_LVDS12/SYSCLK2_N: U1.AA18(IO_L12N_T1_MRCC_33) ; port BANK33_LVDS12/SYSCLK2_N
BANK33_LVDS12/SYSCLK2_P: U1.Y18(IO_L12P_T1_MRCC_33) ; port BANK33_LVDS12/SYSCLK2_P
BANK33_LVDS13_N: U1.W18(IO_L13N_T2_MRCC_33) ; port BANK33_LVDS13_N
BANK33_LVDS13_P: U1.W17(IO_L13P_T2_MRCC_33) ; port BANK33_LVDS13_P
BANK33_LVDS14_N: U1.Y16(IO_L14N_T2_SRCC_33) ; port BANK33_LVDS14_N
BANK33_LVDS14_P: U1.W16(IO_L14P_T2_SRCC_33) ; port BANK33_LVDS14_P
BANK33_LVDS15_N: U1.U16(IO_L15N_T2_DQS_33) ; port BANK33_LVDS15_N
BANK33_LVDS15_P: U1.U15(IO_L15P_T2_DQS_33) ; port BANK33_LVDS15_P
BANK33_LVDS16_N: U1.V17(IO_L16N_T2_33) ; port BANK33_LVDS16_N
BANK33_LVDS16_P: U1.U17(IO_L16P_T2_33) ; port BANK33_LVDS16_P
BANK33_LVDS17_N: U1.AB17(IO_L17N_T2_33) ; port BANK33_LVDS17_N
BANK33_LVDS17_P: U1.AA17(IO_L17P_T2_33) ; port BANK33_LVDS17_P
BANK33_LVDS18_N: U1.AB16(IO_L18N_T2_33) ; port BANK33_LVDS18_N
BANK33_LVDS18_P: U1.AA16(IO_L18P_T2_33) ; port BANK33_LVDS18_P
BANK33_LVDS19_N: U1.V15(IO_L19N_T3_VREF_33) ; port BANK33_LVDS19_N
BANK33_LVDS19_P: U1.V14(IO_L19P_T3_33) ; port BANK33_LVDS19_P
BANK33_LVDS20_N: U1.W13(IO_L20N_T3_33) ; port BANK33_LVDS20_N
BANK33_LVDS20_P: U1.V13(IO_L20P_T3_33) ; port BANK33_LVDS20_P
BANK33_LVDS21_N: U1.Y15(IO_L21N_T3_DQS_33) ; port BANK33_LVDS21_N
BANK33_LVDS21_P: U1.W15(IO_L21P_T3_DQS_33) ; port BANK33_LVDS21_P
BANK33_LVDS22_N: U1.AA14(IO_L22N_T3_33) ; port BANK33_LVDS22_N
BANK33_LVDS22_P: U1.Y14(IO_L22P_T3_33) ; port BANK33_LVDS22_P
BANK33_LVDS23_N: U1.AA13(IO_L23N_T3_33) ; port BANK33_LVDS23_N
BANK33_LVDS23_P: U1.Y13(IO_L23P_T3_33) ; port BANK33_LVDS23_P
BANK33_LVDS24_N: U1.AB15(IO_L24N_T3_33) ; port BANK33_LVDS24_N
BANK33_LVDS24_P: U1.AB14(IO_L24P_T3_33) ; port BANK33_LVDS24_P
CFGBVS: R3.1 U1.T13(CFGBVS_0)
FPGA_DONE: D2.1(A) R4.1 U1.T12(DONE_0) ; port FPGA_DONE
INIT_B: R1.1 U1.T14(INIT_B_0) ; port INIT_B
JTAG_RST_B: J1.14(INIT) ; port JTAG_RST_B
JTAG_TCK: J1.6(TCK) R133.1 U1.G11(TCK_0)
JTAG_TDI: J1.10(TDI) R135.1 U1.H13(TDI_0)
JTAG_TDO: J1.8(TDO) R134.1 U1.G14(TDO_0)
JTAG_TMS: J1.4(TMS) R132.1 U1.G12(TMS_0)
JTAG_VREF: D1.2(K) J1.2(VREF)
PROGRAM_B: R2.1 U1.T11(PROGRAM_B_0)
VREFN_0: C258.2 NT36.1 U1.L12(VREFN_0)
VREFP_0: C258.1 NT35.1 U1.M11(VREFP_0)

Not connected (* = marked no-connect by the designer): J1 12(NC)*; U32 1(DNC)* 2(DNC)* 3(DNC)* 5(TEST)* 7(DNC)* 8(DNC)*

### Layout directives
differential pair: AD16_N, AD16_P, BANK13_LVDS01_N, BANK13_LVDS01_P, BANK13_LVDS02_N, BANK13_LVDS02_P, BANK13_LVDS03_N, BANK13_LVDS03_P, BANK13_LVDS04_N, BANK13_LVDS04_P, BANK13_LVDS05_N, BANK13_LVDS05_P, BANK13_LVDS06_N, BANK13_LVDS06_P, BANK13_LVDS07_N, BANK13_LVDS07_P, BANK13_LVDS08_N, BANK13_LVDS08_P, BANK13_LVDS09_N, BANK13_LVDS09_P, BANK13_LVDS10_N, BANK13_LVDS10_P, BANK13_LVDS11_N, BANK13_LVDS11_P, BANK13_LVDS12/SYSCLK1_N, BANK13_LVDS12/SYSCLK1_P, BANK13_LVDS13_N, BANK13_LVDS13_P, BANK13_LVDS14_N, BANK13_LVDS14_P, BANK13_LVDS15_N, BANK13_LVDS15_P, BANK13_LVDS16_N, BANK13_LVDS16_P, BANK13_LVDS17_N, BANK13_LVDS17_P, BANK13_LVDS18_N, BANK13_LVDS18_P, BANK13_LVDS19_N, BANK13_LVDS19_P, BANK13_LVDS20_N, BANK13_LVDS20_P, BANK13_LVDS21_N, BANK13_LVDS21_P, BANK13_LVDS22_N, BANK13_LVDS22_P, BANK13_LVDS23_N, BANK13_LVDS23_P, BANK13_LVDS24_N, BANK13_LVDS24_P, BANK33_LVDS01_N, BANK33_LVDS01_P, BANK33_LVDS02_N, BANK33_LVDS02_P, BANK33_LVDS03_N, BANK33_LVDS03_P, BANK33_LVDS04_N, BANK33_LVDS04_P, BANK33_LVDS05_N, BANK33_LVDS05_P, BANK33_LVDS06_N, BANK33_LVDS06_P, BANK33_LVDS07_N, BANK33_LVDS07_P, BANK33_LVDS08_N, BANK33_LVDS08_P, BANK33_LVDS09_N, BANK33_LVDS09_P, BANK33_LVDS10_N, BANK33_LVDS10_P, BANK33_LVDS11_N, BANK33_LVDS11_P, BANK33_LVDS12/SYSCLK2_N, BANK33_LVDS12/SYSCLK2_P, BANK33_LVDS13_N, BANK33_LVDS13_P, BANK33_LVDS14_N, BANK33_LVDS14_P, BANK33_LVDS15_N, BANK33_LVDS15_P, BANK33_LVDS16_N, BANK33_LVDS16_P, BANK33_LVDS17_N, BANK33_LVDS17_P, BANK33_LVDS18_N, BANK33_LVDS18_P, BANK33_LVDS19_N, BANK33_LVDS19_P, BANK33_LVDS20_N, BANK33_LVDS20_P, BANK33_LVDS21_N, BANK33_LVDS21_P, BANK33_LVDS22_N, BANK33_LVDS22_P, BANK33_LVDS23_N, BANK33_LVDS23_P, BANK33_LVDS24_N, BANK33_LVDS24_P

### Notes on the sheet
- (near U1) BANK13 I/O to QTH-90
- Differential routing for all labeled differential pairs.
  All other P/N pairs must be length matched ONLY.
  Lane-to-lane match is not necessary.
- (near U1) BANK33 I/O to QTH-90
- VREFP_0 input current 50uA (UG480 pg 70)
  LT1634 Minimum operating current 7uA
- From UG480:
  Place C258 capacitor as close as possible to package balls (see PC Board Design Guidelines, page 72).
  The reference inputs should be routed as a tightly coupled differential pair from the
  reference IC to the package pins.
- (near R4) DONE LED
- PC4 JTAG
- REV.
- DESCRIPTION
- DATE
- APPROVED
- Incal Inc.
- SHEET
- TITLE
- CONFIG.
- PROJECT
- SIZE
- SCH P/N.
- DRAWN
- B
- OF
- (in symbol LTST-C191TBKT) B
- (in symbol XC7Z020-1CLG484C, part A) BANK 13
- (in symbol XC7Z020-1CLG484C, part B) BANK 33

### Library data of the parts
C258 = C0201_0.1uF_10%_6.3V_X5R: as C216 on sheet ADC; Status: Active; Power: *; Current: *; Part Ref: C0201_0.1uF_10%_6.3V_X5R; Comment_1: *; RoHs: True; Operating Temp: -55 to +85 C
C259 = C0603_10uF_10%_10V_X5R: as C215 on sheet ADC; Status: Active; Power: *; Current: *; Part Ref: C0603_10uF_10%_10V_X5R; Comment_1: *; RoHs: True; Operating Temp: -55 to +85 C
D1 = RB521S30: Diode schottky, 30V, 200mA, SOD-523F; Manufacturer 1: ON Semiconductor; Status: Active; Power: *; Current: 200mA; EIA(I) Package: *; EIA(M) Package: *; Part Ref: RB521S30; Tolerance: *; RoHs: True; Package: SOD-523F; Datasheet 1: https://www.onsemi.com/pub/Collateral/RB521S30-D.pdf; Mfg Part Number 1: RB521S30; Operating Temp: -55 to +125 C
D2 = LTST-C191TBKT: Led, Blue, 150mcd, SMT, LTST-C191TBKT, -20 to +80 C, 0603; Manufacturer 1: LITE-ON; EIA(I) Package: 0603; ASSY: USED; Power: 120mW; Current: 20mA; Voltage: 3.2V; Status: Active; EIA(M) Package: *; Part Ref: LTST-C191TBKT; Tolerance: *; Package: *; RoHs: True; Value: LTST-C191TBKT; Operating Temp: -20 to +80 C; Mfg Part Number 1: LTST-C191TBKT
J1 = JTAG_XILINX_SMT_2X7: Connector Header 2mm, 2x7, SMT, Keyed, Shrouded, 0V, 0A, -55 to +105 C; Manufacturer 1: Molex; ASSY: USED; Power: Pow; Comment_1: Com; Value: 87832-1420; Status: Active; EIA(I) Package: *; EIA(M) Package: *; Part Ref: JTAG_XILINX_SMT_2X7; Current: 0A; Tolerance: *; Voltage: 0V; Package: *; RoHs: True; Operating Temp: -55 to +105 C; Mfg Part Number 1: 87832-1420; Datasheet 1: ..\datasheet\Connector\Molex\Header\87831-1420\2012-10-25\
NT35 NT36 = NET_TIE_1X1: Net Tie 1 to 1; ASSY: USED; Status: Active; Power: *; Current: *; EIA(I) Package: *; EIA(M) Package: *; Part Ref: NET_TIE_1X1; Comment_1: *; RoHs: True; Value: NET_TIE; Tolerance: *; Voltage: *
R1-R3 R117 R132-R135 = R0402_4k70_1%: Resistor, 4k7, 1/16W, 1%, -55 to +155 C, EIA0402; Manufacturer 1: Yageo; Mfg Part Number 1: RC0402FR-074k7L; EIA(I) Package: 0402; EIA(M) Package: 1005; Voltage: 50V; ASSY: USED; Status: Active; Part Ref: R0402_4k70_1%; Current: *; Comment_1: *; RoHs: True; Operating Temp: -55 to +155 C; Datasheet 1: ..\datasheet\Resistor\Yaego\Thick_Film\RC0402\2012-03-29; Manufacturer 2: Vishay Dale; Mfg Part Number 2: CRCW04024k70FKED; Datasheet 2: ..\datasheet\Resistor\Vishay Dale\CRC\2012-03-29
R4 = R0402_240R_1%: Resistor, 240R, 1/16W, 1%, -50 to +155 C, EIA0402, EIA(M)1005; Manufacturer 1: Vishay Dale; Mfg Part Number 1: CRCW0402240RFKED; EIA(I) Package: 0402; EIA(M) Package: 1005; Voltage: 50V; ASSY: USED; Status: Active; Part Ref: R0402_240R_1%; Current: *; Comment_1: *; RoHs: True; Operating Temp: -50 to +155 C
U1 = XC7Z020-1CLG484C: 667 MHz Zynq™-7000 AP SoC, 130 PS I/O, 200 FPGA I/O, 484-Ball BGA, Speed Grade 1, Commercial Grade; Manufacturer: Xilinx; Extensible Block RAM (# 36Kb Blocks): 560 KB (140); Flip Flops: 106400; LUTs: 53200; Speed Grade: -1; DatasheetVersion: v1.2; PackageVersion: Rev 1.1; PackageReference: CLG484; PackageDescription: Wire-Bond Chip-Scale BGA, Body 19 x 19 mm, 0.8 mm Pitch; Generic Part Number: XC7Z020; RoHS: True; Mounting Technology: Surface Mount; Code_JEDEC: MO-275-PPAA-2; PartNumber: XC7Z020-1CLG484C; ComponentLink1Description: Datasheet; ComponentLink1URL: http://www.xilinx.com/support/documentation/data_sheets/ds190-Zynq-7000-Overview.pdf; ComponentLink2Description: Package Specification; ComponentLink2URL: http://www.xilinx.com/support/documentation/user_guides/ug865-Zynq-7000-Pkg-Pinout.pdf; ComponentLink3Description: DC and AC Switching Characteristics; ComponentLink3URL: http://www.xilinx.com/support/documentation/data_sheets/ds187-XC7Z010-XC7Z020-Data-Sheet.pdf; ComponentLink4Description: Package File; ComponentLink4URL: http://www.xilinx.com/support/packagefiles/z7packages/xc7z020clg484pkg.txt; ComponentLink5Description: Packaging and Pinout; ComponentLink5URL: http://www.xilinx.com/support/documentation/user_guides/ug865-Zynq-7000-Pkg-Pinout.pdf; ComponentLink6Description: PCB and Layout Guide; ComponentLink6URL: http://www.xilinx.com/support/documentation/user_guides/ug483_7Series_PCB.pdf; Part Ref: XC7Z020-1CLG484C; Status: Active; Value: XC7Z020-1CLG484C; Manufacturer 1: Xilinx; Mfg Part Number 1: XC7Z020-1CLG484C; Package: CLG484
U32 = LT1634BCMS8-1.25#PBF: Reference Shunt 1.25V, 10ppm, 0.05%; Manufacturer 1: Linear Technology; ASSY: USED; Power: Pow; Current: Cur; Voltage: Vol; Status: Active; EIA(I) Package: *; EIA(M) Package: *; Part Ref: LT1634BCMS8-1.25#PBF; Tolerance: ±0.05%; Package: SOT23-5; RoHs: True; Value: 1.25V; Operating Temp: 0 to +70 C

## Sheet Bank34-35.SchDoc: 02290_Sonoma_Controller
size B; ApprovedBy: J Johnson; CheckedBy: J Johnson; Author: sdfasdfdfAEFfasdFfaF; DrawnBy: J Johnson; Organization: Opsero Electronic Design; Address1: 21-915 Av. Marguerite-Bourgeoys; Address2: Québec (QC); Address3: G1S 3X4; DocumentNumber: OP009-001-SCH; Revision: D-1; SheetNumber: 08; SheetTotal: 16; Tel1: (581) 308-8830; Tel2: (581) 308-8830; Project: 02290_Sonoma_Controller; CheckedDate: yyyy-mm-dd; Sheet: Bank34 & Bank35; PageSetup: Record=PageOptions|CenterHorizontal=True|CenterVertical=True|PrintScale=1.08|XCorrection=1.00|YCorrection=1.00|PrintKind=0|BorderSize=5000000|LeftOffset=0|BottomOffset=0|Orientation=2|PaperLength=1000|PaperWidth=1000|Scale=100|PaperSource=7|PrintQuality=-4|MediaType=1|DitherType=10|PaperKind=Tabloid     [11 x 17 in]|PrintScaleMode=1; DrawDate: 2013-12-13; SchTitle: 02290_Sonoma_Controller; RevDescription: Replaced Q2,Q3 with STD16NF06LT4; RevDate: 2020-07-07; RevBy: J Johnson; RevDescription2: Added resistors to QSPI interface; ModifiedDate: 2020-07-07
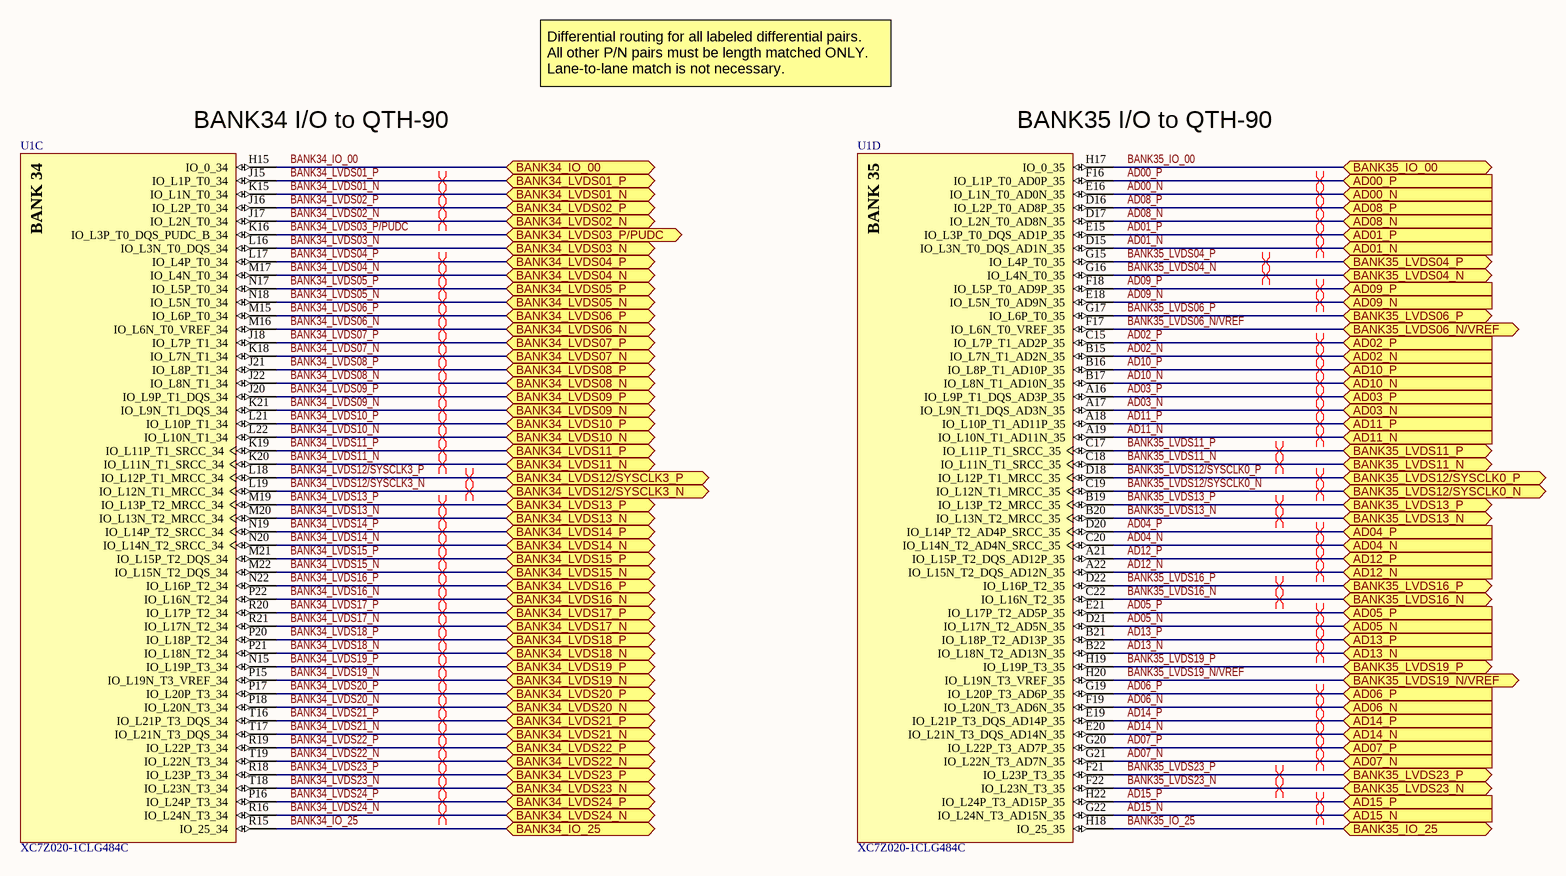
[diagram p3: Bank34-35.SchDoc]

### Parts
U1  XC7Z020-1CLG484C  [CLG484]  (parts C,D of 10)

### Ports
AD00_N (in), AD00_P (in), AD01_N (in), AD01_P (in), AD02_N (in), AD02_P (in), AD03_N (in), AD03_P (in), AD04_N (in), AD04_P (in), AD05_N (in), AD05_P (in), AD06_N (in), AD06_P (in), AD07_N (in), AD07_P (in), AD08_N (in), AD08_P (in), AD09_N (in), AD09_P (in), AD10_N (in), AD10_P (in), AD11_N (in), AD11_P (in), AD12_N (in), AD12_P (in), AD13_N (in), AD13_P (in), AD14_N (in), AD14_P (in), AD15_N (in), AD15_P (in), BANK34_IO_00 (bidir), BANK34_IO_25 (bidir), BANK34_LVDS01_N (bidir), BANK34_LVDS01_P (bidir), BANK34_LVDS02_N (bidir), BANK34_LVDS02_P (bidir), BANK34_LVDS03_N (bidir), BANK34_LVDS03_P/PUDC (bidir), BANK34_LVDS04_N (bidir), BANK34_LVDS04_P (bidir), BANK34_LVDS05_N (bidir), BANK34_LVDS05_P (bidir), BANK34_LVDS06_N (bidir), BANK34_LVDS06_P (bidir), BANK34_LVDS07_N (bidir), BANK34_LVDS07_P (bidir), BANK34_LVDS08_N (bidir), BANK34_LVDS08_P (bidir), BANK34_LVDS09_N (bidir), BANK34_LVDS09_P (bidir), BANK34_LVDS10_N (bidir), BANK34_LVDS10_P (bidir), BANK34_LVDS11_N (bidir), BANK34_LVDS11_P (bidir), BANK34_LVDS12/SYSCLK3_N (bidir), BANK34_LVDS12/SYSCLK3_P (bidir), BANK34_LVDS13_N (bidir), BANK34_LVDS13_P (bidir), BANK34_LVDS14_N (bidir), BANK34_LVDS14_P (bidir), BANK34_LVDS15_N (bidir), BANK34_LVDS15_P (bidir), BANK34_LVDS16_N (bidir), BANK34_LVDS16_P (bidir), BANK34_LVDS17_N (bidir), BANK34_LVDS17_P (bidir), BANK34_LVDS18_N (bidir), BANK34_LVDS18_P (bidir), BANK34_LVDS19_N (bidir), BANK34_LVDS19_P (bidir), BANK34_LVDS20_N (bidir), BANK34_LVDS20_P (bidir), BANK34_LVDS21_N (bidir), BANK34_LVDS21_P (bidir), BANK34_LVDS22_N (bidir), BANK34_LVDS22_P (bidir), BANK34_LVDS23_N (bidir), BANK34_LVDS23_P (bidir), BANK34_LVDS24_N (bidir), BANK34_LVDS24_P (bidir), BANK35_IO_00 (bidir), BANK35_IO_25 (bidir), BANK35_LVDS04_N (bidir), BANK35_LVDS04_P (bidir), BANK35_LVDS06_N/VREF (bidir), BANK35_LVDS06_P (bidir), BANK35_LVDS11_N (bidir), BANK35_LVDS11_P (bidir), BANK35_LVDS12/SYSCLK0_N (bidir), BANK35_LVDS12/SYSCLK0_P (bidir), BANK35_LVDS13_N (bidir), BANK35_LVDS13_P (bidir), BANK35_LVDS16_N (bidir), BANK35_LVDS16_P (bidir), BANK35_LVDS19_N/VREF (bidir), BANK35_LVDS19_P (bidir), BANK35_LVDS23_N (bidir), BANK35_LVDS23_P (bidir)

### Nets
AD00_N: U1.E16(IO_L1N_T0_AD0N_35) ; port AD00_N
AD00_P: U1.F16(IO_L1P_T0_AD0P_35) ; port AD00_P
AD01_N: U1.D15(IO_L3N_T0_DQS_AD1N_35) ; port AD01_N
AD01_P: U1.E15(IO_L3P_T0_DQS_AD1P_35) ; port AD01_P
AD02_N: U1.B15(IO_L7N_T1_AD2N_35) ; port AD02_N
AD02_P: U1.C15(IO_L7P_T1_AD2P_35) ; port AD02_P
AD03_N: U1.A17(IO_L9N_T1_DQS_AD3N_35) ; port AD03_N
AD03_P: U1.A16(IO_L9P_T1_DQS_AD3P_35) ; port AD03_P
AD04_N: U1.C20(IO_L14N_T2_AD4N_SRCC_35) ; port AD04_N
AD04_P: U1.D20(IO_L14P_T2_AD4P_SRCC_35) ; port AD04_P
AD05_N: U1.D21(IO_L17N_T2_AD5N_35) ; port AD05_N
AD05_P: U1.E21(IO_L17P_T2_AD5P_35) ; port AD05_P
AD06_N: U1.F19(IO_L20N_T3_AD6N_35) ; port AD06_N
AD06_P: U1.G19(IO_L20P_T3_AD6P_35) ; port AD06_P
AD07_N: U1.G21(IO_L22N_T3_AD7N_35) ; port AD07_N
AD07_P: U1.G20(IO_L22P_T3_AD7P_35) ; port AD07_P
AD08_N: U1.D17(IO_L2N_T0_AD8N_35) ; port AD08_N
AD08_P: U1.D16(IO_L2P_T0_AD8P_35) ; port AD08_P
AD09_N: U1.E18(IO_L5N_T0_AD9N_35) ; port AD09_N
AD09_P: U1.F18(IO_L5P_T0_AD9P_35) ; port AD09_P
AD10_N: U1.B17(IO_L8N_T1_AD10N_35) ; port AD10_N
AD10_P: U1.B16(IO_L8P_T1_AD10P_35) ; port AD10_P
AD11_N: U1.A19(IO_L10N_T1_AD11N_35) ; port AD11_N
AD11_P: U1.A18(IO_L10P_T1_AD11P_35) ; port AD11_P
AD12_N: U1.A22(IO_L15N_T2_DQS_AD12N_35) ; port AD12_N
AD12_P: U1.A21(IO_L15P_T2_DQS_AD12P_35) ; port AD12_P
AD13_N: U1.B22(IO_L18N_T2_AD13N_35) ; port AD13_N
AD13_P: U1.B21(IO_L18P_T2_AD13P_35) ; port AD13_P
AD14_N: U1.E20(IO_L21N_T3_DQS_AD14N_35) ; port AD14_N
AD14_P: U1.E19(IO_L21P_T3_DQS_AD14P_35) ; port AD14_P
AD15_N: U1.G22(IO_L24N_T3_AD15N_35) ; port AD15_N
AD15_P: U1.H22(IO_L24P_T3_AD15P_35) ; port AD15_P
BANK34_IO_00: U1.H15(IO_0_34) ; port BANK34_IO_00
BANK34_IO_25: U1.R15(IO_25_34) ; port BANK34_IO_25
BANK34_LVDS01_N: U1.K15(IO_L1N_T0_34) ; port BANK34_LVDS01_N
BANK34_LVDS01_P: U1.J15(IO_L1P_T0_34) ; port BANK34_LVDS01_P
BANK34_LVDS02_N: U1.J17(IO_L2N_T0_34) ; port BANK34_LVDS02_N
BANK34_LVDS02_P: U1.J16(IO_L2P_T0_34) ; port BANK34_LVDS02_P
BANK34_LVDS03_N: U1.L16(IO_L3N_T0_DQS_34) ; port BANK34_LVDS03_N
BANK34_LVDS03_P/PUDC: U1.K16(IO_L3P_T0_DQS_PUDC_B_34) ; port BANK34_LVDS03_P/PUDC
BANK34_LVDS04_N: U1.M17(IO_L4N_T0_34) ; port BANK34_LVDS04_N
BANK34_LVDS04_P: U1.L17(IO_L4P_T0_34) ; port BANK34_LVDS04_P
BANK34_LVDS05_N: U1.N18(IO_L5N_T0_34) ; port BANK34_LVDS05_N
BANK34_LVDS05_P: U1.N17(IO_L5P_T0_34) ; port BANK34_LVDS05_P
BANK34_LVDS06_N: U1.M16(IO_L6N_T0_VREF_34) ; port BANK34_LVDS06_N
BANK34_LVDS06_P: U1.M15(IO_L6P_T0_34) ; port BANK34_LVDS06_P
BANK34_LVDS07_N: U1.K18(IO_L7N_T1_34) ; port BANK34_LVDS07_N
BANK34_LVDS07_P: U1.J18(IO_L7P_T1_34) ; port BANK34_LVDS07_P
BANK34_LVDS08_N: U1.J22(IO_L8N_T1_34) ; port BANK34_LVDS08_N
BANK34_LVDS08_P: U1.J21(IO_L8P_T1_34) ; port BANK34_LVDS08_P
BANK34_LVDS09_N: U1.K21(IO_L9N_T1_DQS_34) ; port BANK34_LVDS09_N
BANK34_LVDS09_P: U1.J20(IO_L9P_T1_DQS_34) ; port BANK34_LVDS09_P
BANK34_LVDS10_N: U1.L22(IO_L10N_T1_34) ; port BANK34_LVDS10_N
BANK34_LVDS10_P: U1.L21(IO_L10P_T1_34) ; port BANK34_LVDS10_P
BANK34_LVDS11_N: U1.K20(IO_L11N_T1_SRCC_34) ; port BANK34_LVDS11_N
BANK34_LVDS11_P: U1.K19(IO_L11P_T1_SRCC_34) ; port BANK34_LVDS11_P
BANK34_LVDS12/SYSCLK3_N: U1.L19(IO_L12N_T1_MRCC_34) ; port BANK34_LVDS12/SYSCLK3_N
BANK34_LVDS12/SYSCLK3_P: U1.L18(IO_L12P_T1_MRCC_34) ; port BANK34_LVDS12/SYSCLK3_P
BANK34_LVDS13_N: U1.M20(IO_L13N_T2_MRCC_34) ; port BANK34_LVDS13_N
BANK34_LVDS13_P: U1.M19(IO_L13P_T2_MRCC_34) ; port BANK34_LVDS13_P
BANK34_LVDS14_N: U1.N20(IO_L14N_T2_SRCC_34) ; port BANK34_LVDS14_N
BANK34_LVDS14_P: U1.N19(IO_L14P_T2_SRCC_34) ; port BANK34_LVDS14_P
BANK34_LVDS15_N: U1.M22(IO_L15N_T2_DQS_34) ; port BANK34_LVDS15_N
BANK34_LVDS15_P: U1.M21(IO_L15P_T2_DQS_34) ; port BANK34_LVDS15_P
BANK34_LVDS16_N: U1.P22(IO_L16N_T2_34) ; port BANK34_LVDS16_N
BANK34_LVDS16_P: U1.N22(IO_L16P_T2_34) ; port BANK34_LVDS16_P
BANK34_LVDS17_N: U1.R21(IO_L17N_T2_34) ; port BANK34_LVDS17_N
BANK34_LVDS17_P: U1.R20(IO_L17P_T2_34) ; port BANK34_LVDS17_P
BANK34_LVDS18_N: U1.P21(IO_L18N_T2_34) ; port BANK34_LVDS18_N
BANK34_LVDS18_P: U1.P20(IO_L18P_T2_34) ; port BANK34_LVDS18_P
BANK34_LVDS19_N: U1.P15(IO_L19N_T3_VREF_34) ; port BANK34_LVDS19_N
BANK34_LVDS19_P: U1.N15(IO_L19P_T3_34) ; port BANK34_LVDS19_P
BANK34_LVDS20_N: U1.P18(IO_L20N_T3_34) ; port BANK34_LVDS20_N
BANK34_LVDS20_P: U1.P17(IO_L20P_T3_34) ; port BANK34_LVDS20_P
BANK34_LVDS21_N: U1.T17(IO_L21N_T3_DQS_34) ; port BANK34_LVDS21_N
BANK34_LVDS21_P: U1.T16(IO_L21P_T3_DQS_34) ; port BANK34_LVDS21_P
BANK34_LVDS22_N: U1.T19(IO_L22N_T3_34) ; port BANK34_LVDS22_N
BANK34_LVDS22_P: U1.R19(IO_L22P_T3_34) ; port BANK34_LVDS22_P
BANK34_LVDS23_N: U1.T18(IO_L23N_T3_34) ; port BANK34_LVDS23_N
BANK34_LVDS23_P: U1.R18(IO_L23P_T3_34) ; port BANK34_LVDS23_P
BANK34_LVDS24_N: U1.R16(IO_L24N_T3_34) ; port BANK34_LVDS24_N
BANK34_LVDS24_P: U1.P16(IO_L24P_T3_34) ; port BANK34_LVDS24_P
BANK35_IO_00: U1.H17(IO_0_35) ; port BANK35_IO_00
BANK35_IO_25: U1.H18(IO_25_35) ; port BANK35_IO_25
BANK35_LVDS04_N: U1.G16(IO_L4N_T0_35) ; port BANK35_LVDS04_N
BANK35_LVDS04_P: U1.G15(IO_L4P_T0_35) ; port BANK35_LVDS04_P
BANK35_LVDS06_N/VREF: U1.F17(IO_L6N_T0_VREF_35) ; port BANK35_LVDS06_N/VREF
BANK35_LVDS06_P: U1.G17(IO_L6P_T0_35) ; port BANK35_LVDS06_P
BANK35_LVDS11_N: U1.C18(IO_L11N_T1_SRCC_35) ; port BANK35_LVDS11_N
BANK35_LVDS11_P: U1.C17(IO_L11P_T1_SRCC_35) ; port BANK35_LVDS11_P
BANK35_LVDS12/SYSCLK0_N: U1.C19(IO_L12N_T1_MRCC_35) ; port BANK35_LVDS12/SYSCLK0_N
BANK35_LVDS12/SYSCLK0_P: U1.D18(IO_L12P_T1_MRCC_35) ; port BANK35_LVDS12/SYSCLK0_P
BANK35_LVDS13_N: U1.B20(IO_L13N_T2_MRCC_35) ; port BANK35_LVDS13_N
BANK35_LVDS13_P: U1.B19(IO_L13P_T2_MRCC_35) ; port BANK35_LVDS13_P
BANK35_LVDS16_N: U1.C22(IO_L16N_T2_35) ; port BANK35_LVDS16_N
BANK35_LVDS16_P: U1.D22(IO_L16P_T2_35) ; port BANK35_LVDS16_P
BANK35_LVDS19_N/VREF: U1.H20(IO_L19N_T3_VREF_35) ; port BANK35_LVDS19_N/VREF
BANK35_LVDS19_P: U1.H19(IO_L19P_T3_35) ; port BANK35_LVDS19_P
BANK35_LVDS23_N: U1.F22(IO_L23N_T3_35) ; port BANK35_LVDS23_N
BANK35_LVDS23_P: U1.F21(IO_L23P_T3_35) ; port BANK35_LVDS23_P

### Layout directives
differential pair: AD00_N, AD00_P, AD01_N, AD01_P, AD02_N, AD02_P, AD03_N, AD03_P, AD04_N, AD04_P, AD05_N, AD05_P, AD06_N, AD06_P, AD07_N, AD07_P, AD08_N, AD08_P, AD09_N, AD09_P, AD10_N, AD10_P, AD11_N, AD11_P, AD12_N, AD12_P, AD13_N, AD13_P, AD14_N, AD14_P, AD15_N, AD15_P, BANK34_LVDS01_N, BANK34_LVDS01_P, BANK34_LVDS02_N, BANK34_LVDS02_P, BANK34_LVDS04_N, BANK34_LVDS04_P, BANK34_LVDS05_N, BANK34_LVDS05_P, BANK34_LVDS06_N, BANK34_LVDS06_P, BANK34_LVDS07_N, BANK34_LVDS07_P, BANK34_LVDS08_N, BANK34_LVDS08_P, BANK34_LVDS09_N, BANK34_LVDS09_P, BANK34_LVDS10_N, BANK34_LVDS10_P, BANK34_LVDS11_N, BANK34_LVDS11_P, BANK34_LVDS12/SYSCLK3_N, BANK34_LVDS12/SYSCLK3_P, BANK34_LVDS13_N, BANK34_LVDS13_P, BANK34_LVDS14_N, BANK34_LVDS14_P, BANK34_LVDS15_N, BANK34_LVDS15_P, BANK34_LVDS16_N, BANK34_LVDS16_P, BANK34_LVDS17_N, BANK34_LVDS17_P, BANK34_LVDS18_N, BANK34_LVDS18_P, BANK34_LVDS19_N, BANK34_LVDS19_P, BANK34_LVDS20_N, BANK34_LVDS20_P, BANK34_LVDS21_N, BANK34_LVDS21_P, BANK34_LVDS22_N, BANK34_LVDS22_P, BANK34_LVDS23_N, BANK34_LVDS23_P, BANK34_LVDS24_N, BANK34_LVDS24_P, BANK35_LVDS04_N, BANK35_LVDS04_P, BANK35_LVDS11_N, BANK35_LVDS11_P, BANK35_LVDS12/SYSCLK0_N, BANK35_LVDS12/SYSCLK0_P, BANK35_LVDS13_N, BANK35_LVDS13_P, BANK35_LVDS16_N, BANK35_LVDS16_P, BANK35_LVDS23_N, BANK35_LVDS23_P

### Notes on the sheet
- Differential routing for all labeled differential pairs.
  All other P/N pairs must be length matched ONLY.
  Lane-to-lane match is not necessary.
- (near U1) BANK34 I/O to QTH-90
- (near U1) BANK35 I/O to QTH-90
- REV.
- DESCRIPTION
- DATE
- APPROVED
- Incal Inc.
- SHEET
- TITLE
- CONFIG.
- PROJECT
- SIZE
- SCH P/N.
- DRAWN
- B
- OF
- (in symbol XC7Z020-1CLG484C, part C) BANK 34
- (in symbol XC7Z020-1CLG484C, part D) BANK 35

### Library data of the parts
U1 = XC7Z020-1CLG484C: as U1 on sheet Bank0-13-33; DatasheetVersion: v1.2; PackageVersion: Rev 1.1; PackageReference: CLG484; PackageDescription: Wire-Bond Chip-Scale BGA, Body 19 x 19 mm, 0.8 mm Pitch; Generic Part Number: XC7Z020; RoHS: True; Mounting Technology: Surface Mount; Code_JEDEC: MO-275-PPAA-2; PartNumber: XC7Z020-1CLG484C; ComponentLink1Description: Datasheet; ComponentLink1URL: http://www.xilinx.com/support/documentation/data_sheets/ds190-Zynq-7000-Overview.pdf; ComponentLink2Description: Package Specification; ComponentLink2URL: http://www.xilinx.com/support/documentation/user_guides/ug865-Zynq-7000-Pkg-Pinout.pdf; ComponentLink3Description: DC and AC Switching Characteristics; ComponentLink3URL: http://www.xilinx.com/support/documentation/data_sheets/ds187-XC7Z010-XC7Z020-Data-Sheet.pdf; ComponentLink4Description: Package File; ComponentLink4URL: http://www.xilinx.com/support/packagefiles/z7packages/xc7z020clg484pkg.txt; ComponentLink5Description: Packaging and Pinout; ComponentLink5URL: http://www.xilinx.com/support/documentation/user_guides/ug865-Zynq-7000-Pkg-Pinout.pdf; ComponentLink6Description: PCB and Layout Guide; ComponentLink6URL: http://www.xilinx.com/support/documentation/user_guides/ug483_7Series_PCB.pdf; Part Ref: XC7Z020-1CLG484C; Status: Active; Value: XC7Z020-1CLG484C; Manufacturer 1: Xilinx; Mfg Part Number 1: XC7Z020-1CLG484C; Package: CLG484